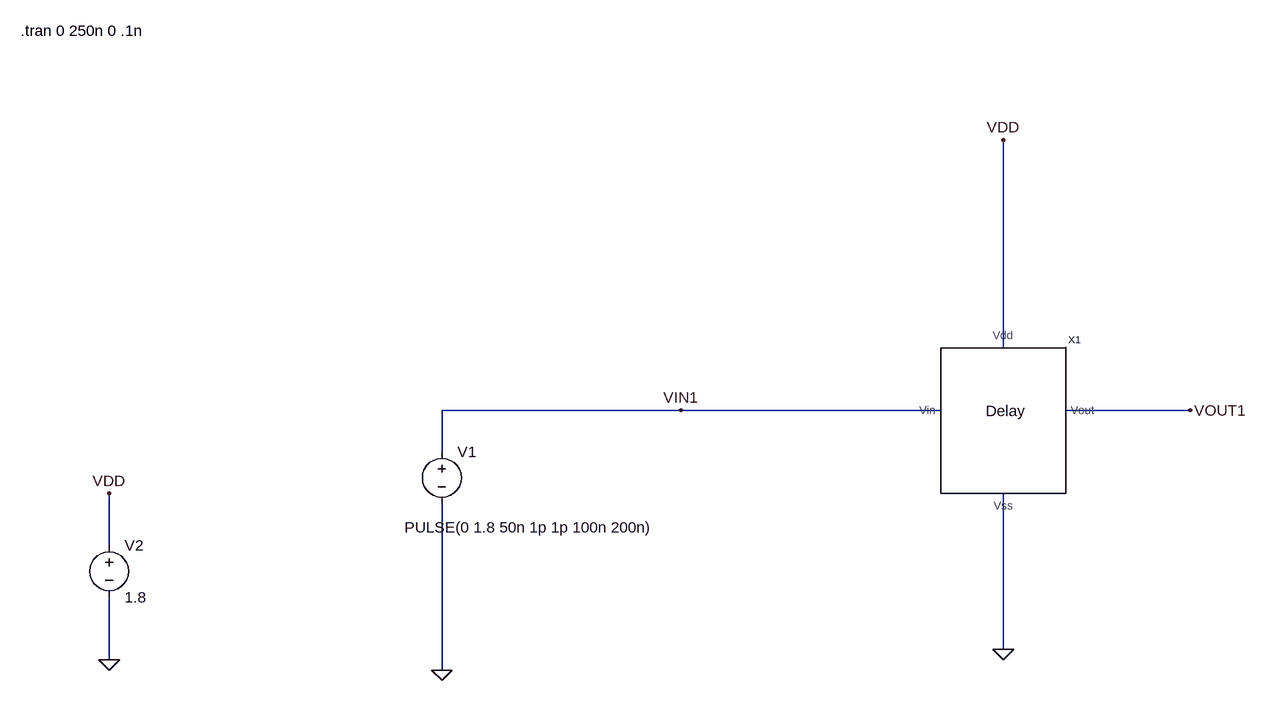
[diagram p0: schematic delay_tb.asc]
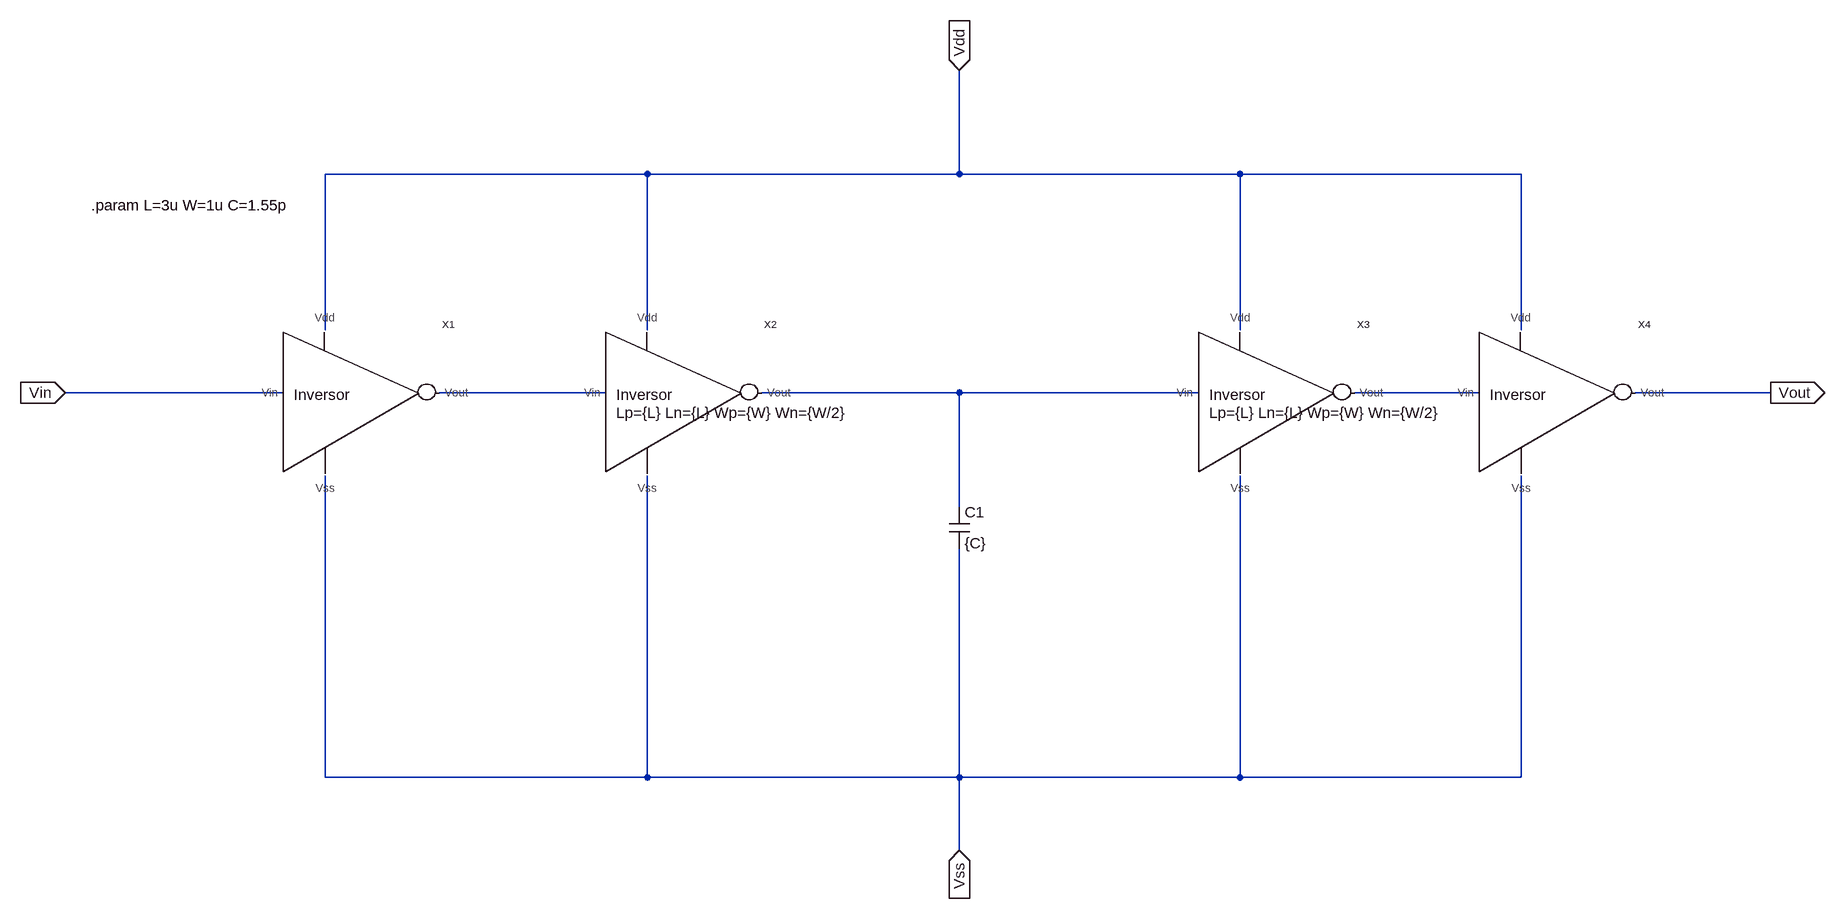
[diagram p1: sub-circuit delay.asc]
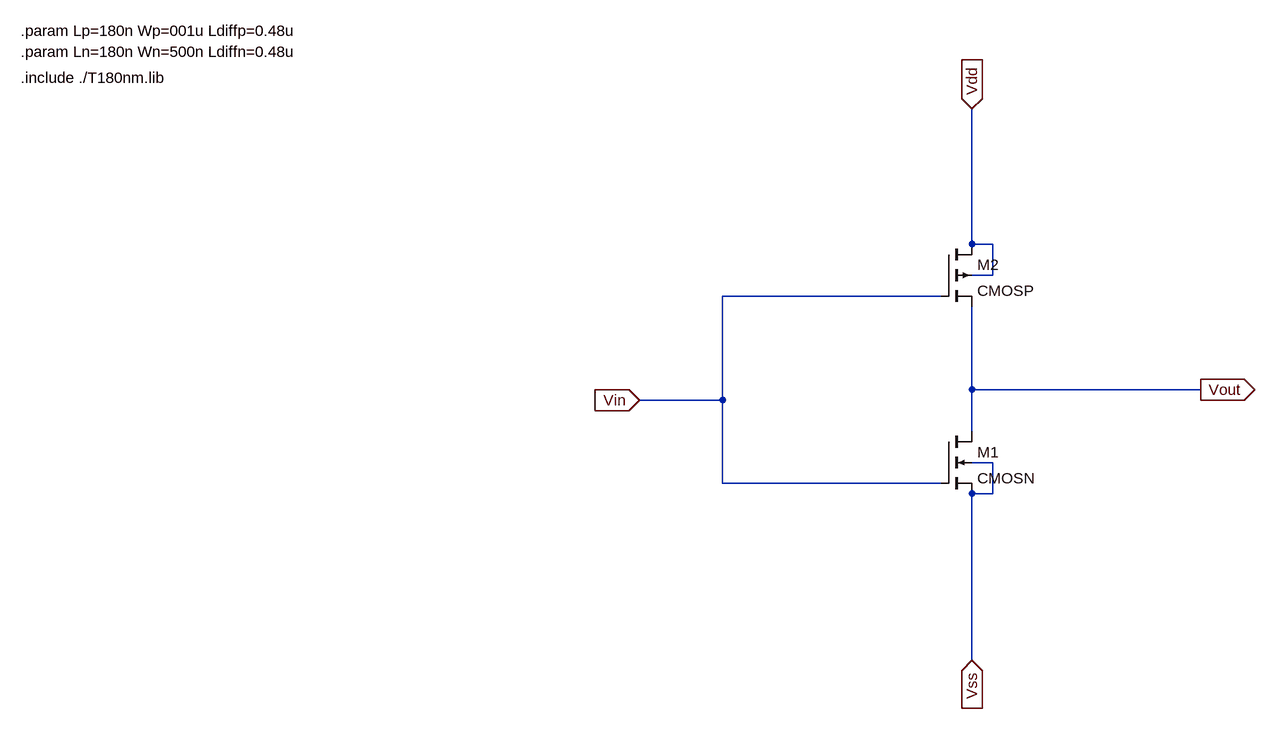
[diagram p2: sub-circuit inversor.asc]
delay_tb.asc, the LTspice schematic file:
Version 4
SHEET 1 880 1476
WIRE 272 32 272 -288
WIRE -224 128 -592 128
WIRE 176 128 -224 128
WIRE 560 128 368 128
WIRE -592 192 -592 128
WIRE -1104 336 -1104 256
WIRE 272 496 272 256
WIRE -1104 512 -1104 416
WIRE -592 528 -592 272
FLAG 272 496 0
FLAG 272 -288 VDD
FLAG 560 128 VOUT1
FLAG -224 128 VIN1
FLAG -1104 512 0
FLAG -592 528 0
FLAG -1104 256 VDD
SYMBOL voltage -592 176 R0
WINDOW 3 -57 132 Left 2
WINDOW 123 0 0 Left 2
WINDOW 39 0 0 Left 2
SYMATTR Value PULSE(0 1.8 50n 1p 1p 100n 200n)
SYMATTR InstName V1
SYMBOL voltage -1104 320 R0
WINDOW 123 0 0 Left 2
WINDOW 39 0 0 Left 2
SYMATTR InstName V2
SYMATTR Value 1.8
SYMBOL delay 240 128 R0
SYMATTR InstName X1
TEXT -1240 -456 Left 2 !.tran 0 250n 0 .1n

delay.asc, the sub-circuit schematic file:
Version 4
SHEET 1 2560 1476
WIRE 720 -208 224 -208
WIRE 1200 -208 1200 -368
WIRE 1200 -208 720 -208
WIRE 1632 -208 1200 -208
WIRE 2064 -208 1632 -208
WIRE 224 32 224 -208
WIRE 720 32 720 -208
WIRE 1632 32 1632 -208
WIRE 2064 32 2064 -208
WIRE 160 128 -176 128
WIRE 656 128 400 128
WIRE 1200 128 896 128
WIRE 1568 128 1200 128
WIRE 2000 128 1808 128
WIRE 2448 128 2240 128
WIRE 1200 304 1200 128
WIRE 224 720 224 256
WIRE 720 720 720 256
WIRE 720 720 224 720
WIRE 1200 720 1200 368
WIRE 1200 720 720 720
WIRE 1632 720 1632 256
WIRE 1632 720 1200 720
WIRE 2064 720 2064 256
WIRE 2064 720 1632 720
WIRE 1200 832 1200 720
FLAG -176 128 Vin
IOPIN -176 128 In
FLAG 1200 -368 Vdd
IOPIN 1200 -368 In
FLAG 1200 832 Vss
IOPIN 1200 832 In
FLAG 2448 128 Vout
IOPIN 2448 128 Out
SYMBOL inversor 224 128 R0
SYMATTR InstName X1
SYMBOL inversor 720 128 R0
WINDOW 39 -48 31 Left 2
SYMATTR SpiceLine Lp={L} Ln={L} Wp={W} Wn={W/2}
SYMATTR InstName X2
SYMBOL inversor 1632 128 R0
WINDOW 39 -48 31 Left 2
SYMATTR SpiceLine Lp={L} Ln={L} Wp={W} Wn={W/2}
SYMATTR InstName X3
SYMBOL cap 1184 304 R0
SYMATTR InstName C1
SYMATTR Value {C}
SYMBOL inversor 2064 128 R0
SYMATTR InstName X4
TEXT -136 -160 Left 2 !.param L=3u W=1u C=1.55p

inversor.asc, the sub-circuit schematic file:
Version 4
SHEET 1 880 712
WIRE 224 -96 224 -304
WIRE 256 -96 224 -96
WIRE 256 -48 256 -96
WIRE 256 -48 224 -48
WIRE 176 -16 -160 -16
WIRE 224 128 224 0
WIRE 576 128 224 128
WIRE -160 144 -160 -16
WIRE -160 144 -288 144
WIRE 224 192 224 128
WIRE 256 240 224 240
WIRE -160 272 -160 144
WIRE 176 272 -160 272
WIRE 256 288 256 240
WIRE 256 288 224 288
WIRE 224 544 224 288
FLAG -288 144 Vin
IOPIN -288 144 In
FLAG 576 128 Vout
IOPIN 576 128 Out
FLAG 224 -304 Vdd
IOPIN 224 -304 In
FLAG 224 544 Vss
IOPIN 224 544 In
SYMBOL nmos4 176 192 R0
SYMATTR InstName M1
SYMATTR Value CMOSN
SYMATTR Value2 l={Ln} w={Wn} ad={Ldiffn*Wn} as={Ldiffn*Wn} pd={2*Ldiffn+Wn} ps={2*Ldiffn+Wn}
SYMBOL pmos4 176 -96 R0
SYMATTR InstName M2
SYMATTR Value CMOSP
SYMATTR Value2 l={Lp} w={Wp} ad={Ldiffp*Wp} as={Ldiffp*Wp} pd={2*Ldiffp+Wp} ps={2*Ldiffp+Wp}
TEXT -1240 -352 Left 2 !.include ./T180nm.lib
TEXT -1240 -424 Left 2 !.param Lp=180n Wp=001u Ldiffp=0.48u
TEXT -1240 -392 Left 2 !.param Ln=180n Wn=500n Ldiffn=0.48u

The netlist it stands for:
* delay_tb.asc
V1 VIN1 0 PULSE(0 1.8 50n 1p 1p 100n 200n)
V2 VDD 0 1.8
XX1 VIN1 VDD 0 VOUT1 delay

* block symbol definitions
.subckt delay Vin Vdd Vss Vout
XX1 Vin Vdd Vss N001 inversor
XX2 N001 Vdd Vss N002 inversor params: Lp={L} Ln={L} Wp={W} Wn={W/2}
XX3 N002 Vdd Vss N003 inversor params: Lp={L} Ln={L} Wp={W} Wn={W/2}
C1 N002 Vss {C}
XX4 N003 Vdd Vss Vout inversor
.param L=3u W=1u C=1.55p
.ends delay

.subckt inversor Vin Vdd Vss Vout
M1 Vout Vin Vss Vss CMOSN l={Ln} w={Wn} ad={Ldiffn*Wn} as={Ldiffn*Wn} pd={2*Ldiffn+Wn} ps={2*Ldiffn+Wn}
M2 Vdd Vin Vout Vdd CMOSP l={Lp} w={Wp} ad={Ldiffp*Wp} as={Ldiffp*Wp} pd={2*Ldiffp+Wp} ps={2*Ldiffp+Wp}
.include ./T180nm.lib
.param Lp=180n Wp=001u Ldiffp=0.48u
.param Ln=180n Wn=500n Ldiffn=0.48u
.ends inversor

.model NMOS NMOS
.model PMOS PMOS
.lib standard.mos
.tran 0 250n 0 .1n
.backanno
.end